# EAGLE design DCSTB-X6 (EAGLE 9.6.2)
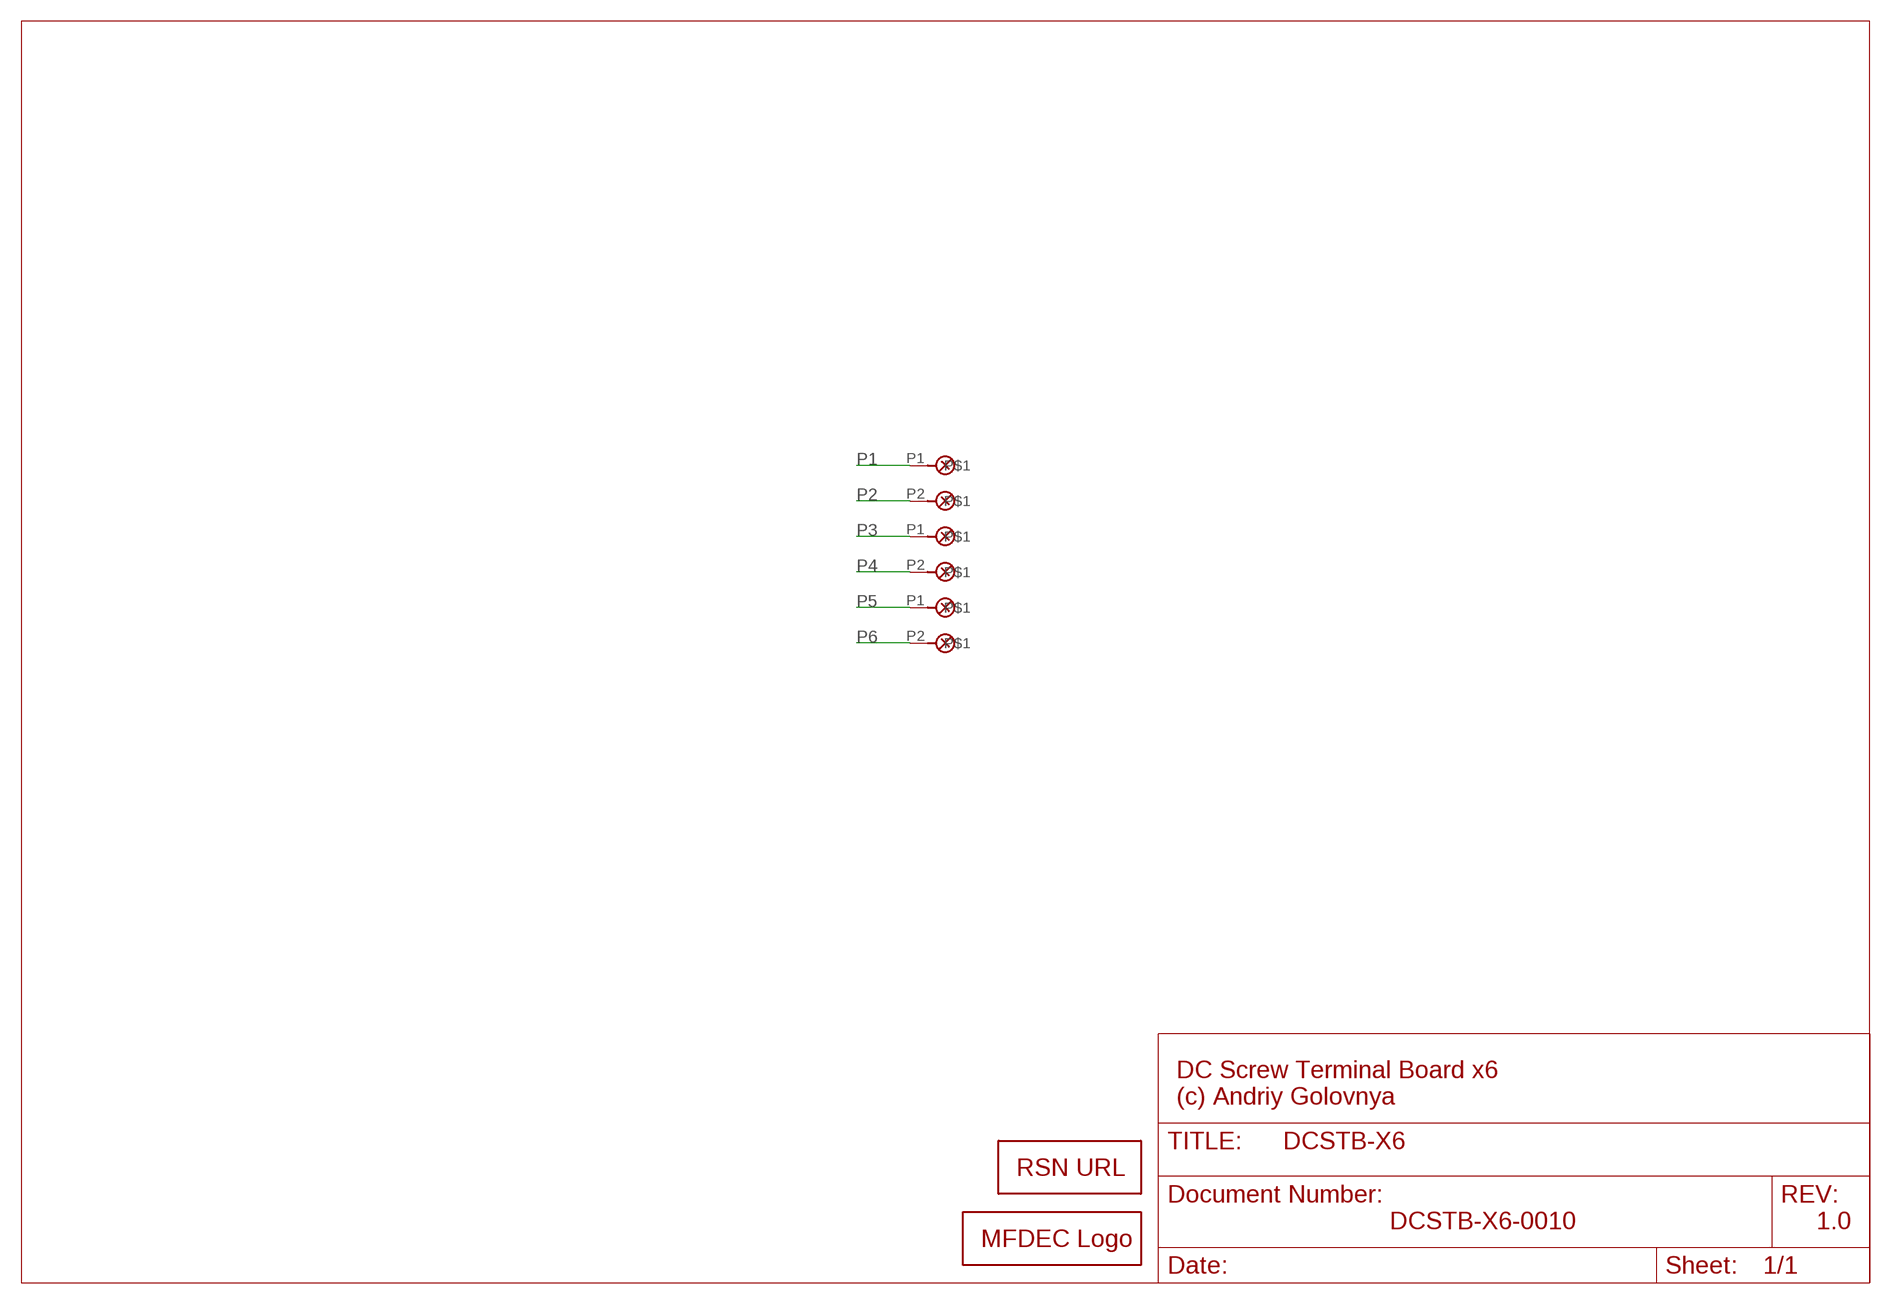
[diagram p0: schematic, sheet 1]

## Parts
LOGO1  MFDECLOGO_L_10MM  [MFDEC_L_10MM]
LOGO2  RSNURL_QR_10MM  [RSNURL_QR_10MM]
U$1  KF8500-8.5-2P  [KF8500-8.5-2P]
U$2  KF8500-8.5-2P  [KF8500-8.5-2P]
U$3  KF8500-8.5-2P  [KF8500-8.5-2P]

## Nets
P1: U$1.P1
P2: U$1.P2
P3: U$2.P1
P4: U$2.P2
P5: U$3.P1
P6: U$3.P2

## Notes on the sheet
- DC Screw Terminal Board x6
  (c) Andriy Golovnya
- DCSTB-X6-0010 | 1.0

## Library data of the parts
LOGO1 = _my_logos:MFDECLOGO: Midnight Fog - Digital Eye Candy LOGO
LOGO2 = _my_logos:RSNURL: RedScorp.Net URL
U$1-U$3 = KF8500-Terminals:KF8500-8.5-2P

## Board
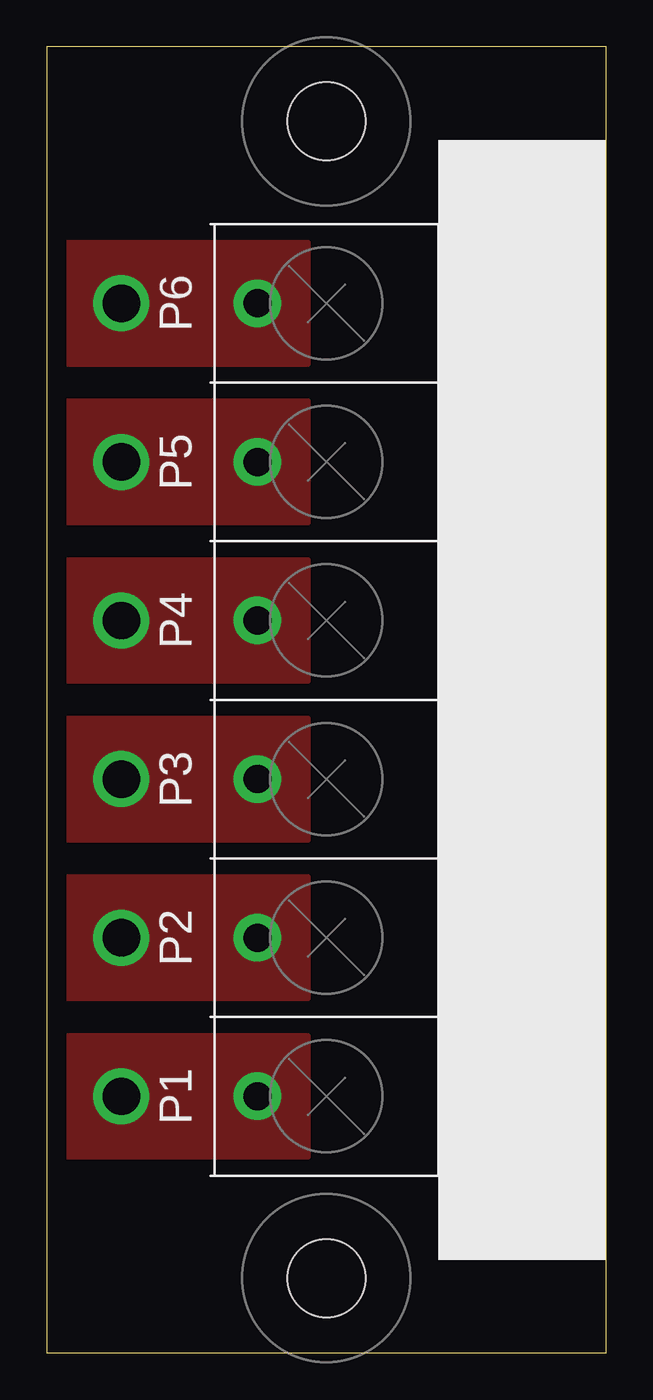
[diagram p1: board, top side]
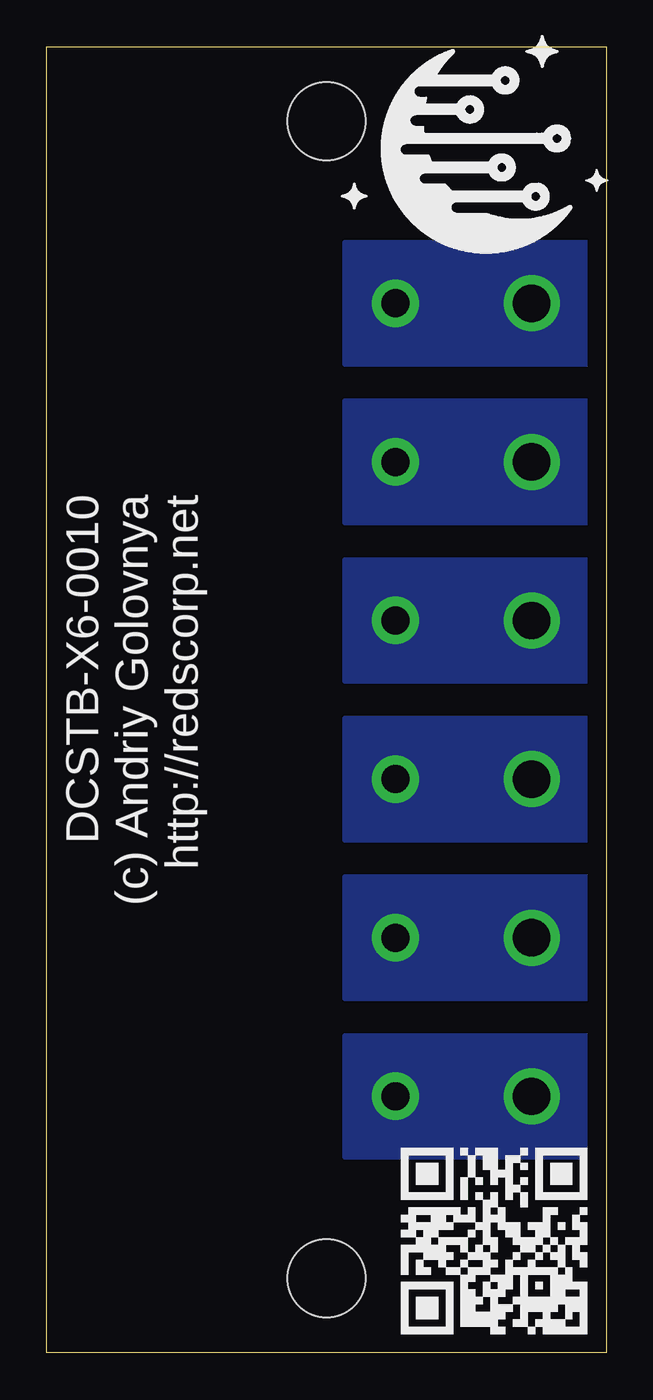
[diagram p2: board, bottom side, seen from below]

Size 30 x 70 mm. Coordinates in mm from the lower left corner, seen from the top.
Outline: 0,0 30,0 30,70 0,70 0,0
Copper layers (1*16): Top 0.035mm / dielectric 1.5mm / Bottom 0.035mm
Design rules "default": minimum track width 6mil, minimum drill 0.35mm, track to track 6mil, track to pad 6mil, pad to pad 6mil, via to via 6mil, smd to smd 6mil, copper to edge 40mil, drill to drill 6mil, minimum pad ring 10mil, minimum via ring 8mil, stop-mask expansion 4mil, vias tented up to drill 0mil, thermal gap 10mil
Holes 4.2 mm at 15,4 15,66

### Footprints (pad centres in the part's own frame; a part is rotated, then mirrored left to right if it is on the bottom)
KF8500-8.5-2P = drill 1.5 pad 2.54: P1 -4.25,3.7; P2 4.25,3.7

### Placement (x,y rotation side)
LOGO1  15,58 0 bottom
LOGO2  11,1 0 bottom
U$1  15,18 90 top
U$2  15,35 90 top
U$3  15,52 90 top

### Tracks (layer width: path | path; a pad name or v marks a point on that pad's centre or on a via)
P1  (via drill 2)
  other vias: 4,13.75
  pour Top (no thermals): 1,17 14,17 14,10.5 1,10.5
  pour Bottom (no thermals): 1,17 1,10.5 14,10.5 14,17
P2  (via drill 2)
  other vias: 4,22.25
  pour Bottom (no thermals): 1,19 14,19 14,25.5 1,25.5
  pour Top (no thermals): 1,19 1,25.5 14,25.5 14,19
P3  (via drill 2)
  other vias: 4,30.75
  pour Top (no thermals): 14,34 1,34 1,27.5 14,27.5
  pour Bottom (no thermals): 14,27.5 1,27.5 1,34 14,34
P4  (via drill 2)
  other vias: 4,39.25
  pour Top (no thermals): 14,36 1,36 1,42.5 14,42.5
  pour Bottom (no thermals): 14,36 1,36 1,42.5 14,42.5
P5  (via drill 2)
  other vias: 4,47.75
  pour Top (no thermals): 1,44.5 14,44.5 14,51 1,51
  pour Bottom (no thermals): 1,44.5 1,51 14,51 14,44.5
P6  (via drill 2)
  other vias: 4,56.25
  pour Top (no thermals): 1,53 14,53 14,59.5 1,59.5
  pour Bottom (no thermals): 1,53 1,59.5 14,59.5 14,53

### Text on the board
tPlace: P6 | P5 | P4 | P3 | P2 | P1
bPlace: DCSTB-X6-0010 / (c) Andriy Golovnya / http://redscorp.net